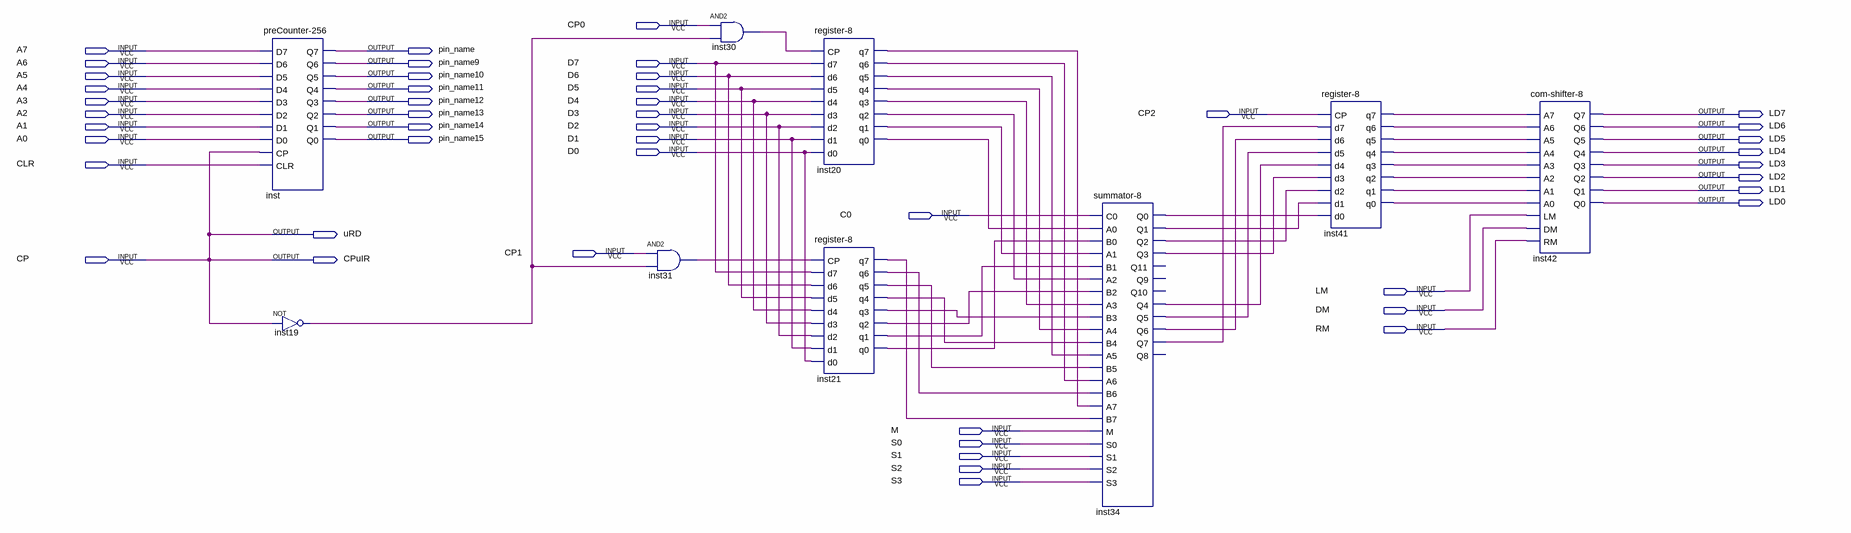
[diagram p0: schematic sheet]
// Quartus schematic microcounter.bdf as structural Verilog: 9 symbols, 48 pins
module microcounter (
  input  CP0,
  input  A7,
  input  A6,
  input  D7,
  input  A5,
  input  D6,
  input  A4,
  input  D5,
  input  A3,
  input  D4,
  input  A2,
  input  D3,
  input  CP2,
  input  A1,
  input  D2,
  input  A0,
  input  D1,
  input  D0,
  input  CLR,
  input  C0,
  input  CP1,
  input  CP,
  input  LM,
  input  DM,
  input  RM,
  input  M,
  input  S0,
  input  S1,
  input  S2,
  input  S3,
  output pin_name,
  output pin_name9,
  output pin_name10,
  output pin_name11,
  output pin_name12,
  output pin_name13,
  output LD7,
  output pin_name14,
  output LD6,
  output pin_name15,
  output LD5,
  output LD4,
  output LD3,
  output LD2,
  output LD1,
  output LD0,
  output uRD,
  output CPuIR
);

  wire inst19_out, inst20_q0, inst20_q1, inst20_q2, inst20_q3, inst20_q4, inst20_q5, inst20_q6, inst20_q7,
       inst21_q0, inst21_q1, inst21_q2, inst21_q3, inst21_q4, inst21_q5, inst21_q6, inst21_q7, inst30_out,
       inst31_out, inst34_q0, inst34_q1, inst34_q2, inst34_q3, inst34_q4, inst34_q5, inst34_q6, inst34_q7,
       inst41_q0, inst41_q1, inst41_q2, inst41_q3, inst41_q4, inst41_q5, inst41_q6, inst41_q7;

  \preCounter-256  inst (
    .D7(A7), .D6(A6), .D5(A5), .D4(A4), .D3(A3), .D2(A2), .D1(A1), .D0(A0), .CP(CP), .CLR(CLR),
    .Q7(pin_name), .Q6(pin_name9), .Q5(pin_name10), .Q4(pin_name11), .Q3(pin_name12), .Q2(pin_name13),
    .Q1(pin_name14), .Q0(pin_name15));
  not inst19 (inst19_out, CP);
  and inst31 (inst31_out, CP1, inst19_out);
  and inst30 (inst30_out, CP0, inst19_out);
  \register-8  inst20 (
    .CP(inst30_out), .d7(D7), .d6(D6), .d5(D5), .d4(D4), .d3(D3), .d2(D2), .d1(D1), .d0(D0), .q7(inst20_q7),
    .q6(inst20_q6), .q5(inst20_q5), .q4(inst20_q4), .q3(inst20_q3), .q2(inst20_q2), .q1(inst20_q1),
    .q0(inst20_q0));
  \register-8  inst21 (
    .CP(inst31_out), .d7(D7), .d6(D6), .d5(D5), .d4(D4), .d3(D3), .d2(D2), .d1(D1), .d0(D0), .q7(inst21_q7),
    .q6(inst21_q6), .q5(inst21_q5), .q4(inst21_q4), .q3(inst21_q3), .q2(inst21_q2), .q1(inst21_q1),
    .q0(inst21_q0));
  \summator-8  inst34 (
    .C0(C0), .A0(inst20_q0), .B0(inst21_q0), .A1(inst20_q1), .B1(inst21_q1), .A2(inst20_q2), .B2(inst21_q2),
    .A3(inst20_q3), .B3(inst21_q3), .A4(inst20_q4), .B4(inst21_q4), .A5(inst20_q5), .B5(inst21_q5),
    .A6(inst20_q6), .B6(inst21_q6), .A7(inst20_q7), .B7(inst21_q7), .M(M), .S0(S0), .S1(S1), .S2(S2),
    .S3(S3), .Q0(inst34_q0), .Q1(inst34_q1), .Q2(inst34_q2), .Q3(inst34_q3), .Q4(inst34_q4), .Q5(inst34_q5),
    .Q6(inst34_q6), .Q7(inst34_q7));  // open: Q11, Q9, Q10, Q8
  \register-8  inst41 (
    .CP(CP2), .d7(inst34_q7), .d6(inst34_q6), .d5(inst34_q5), .d4(inst34_q4), .d3(inst34_q3), .d2(inst34_q2),
    .d1(inst34_q1), .d0(inst34_q0), .q7(inst41_q7), .q6(inst41_q6), .q5(inst41_q5), .q4(inst41_q4),
    .q3(inst41_q3), .q2(inst41_q2), .q1(inst41_q1), .q0(inst41_q0));
  \com-shifter-8  inst42 (
    .A7(inst41_q7), .A6(inst41_q6), .A5(inst41_q5), .A4(inst41_q4), .A3(inst41_q3), .A2(inst41_q2),
    .A1(inst41_q1), .A0(inst41_q0), .LM(LM), .DM(DM), .RM(RM), .Q7(LD7), .Q6(LD6), .Q5(LD5), .Q4(LD4),
    .Q3(LD3), .Q2(LD2), .Q1(LD1), .Q0(LD0));

  assign CPuIR = CP;
  assign uRD = CP;
endmodule
